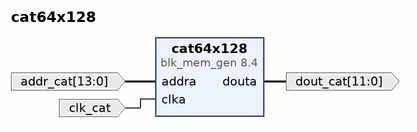
[diagram p0: block diagram of the top level]
# Vivado block design cat64x128, xc7a35tcpg236-1, Vivado 2023.2
create_bd_design cat64x128

create_bd_port -dir I -from 13 -to 0 addr_cat
create_bd_port -dir I -type clk clk_cat
create_bd_port -dir O -from 11 -to 0 dout_cat

create_bd_cell -type ip -vlnv xilinx.com:ip:blk_mem_gen:8.4 cat64x128
set_property -dict [list \
  CONFIG.Coe_File c:/Digital_Sys_Design/vga_sprites/vga_sprites.documents/cat.coe \
  CONFIG.Enable_A Always_Enabled \
  CONFIG.Load_Init_File true \
  CONFIG.Memory_Type Single_Port_ROM \
  CONFIG.Write_Depth_A 8193 \
  CONFIG.Write_Width_A 12 \
  CONFIG.use_bram_block Stand_Alone \
] [get_bd_cells cat64x128]

# ---- connections ----

connect_bd_net -net addra_0_1 [get_bd_ports addr_cat] [get_bd_pins cat64x128/addra]
connect_bd_net [get_bd_pins cat64x128/douta] [get_bd_ports dout_cat]
connect_bd_net -net clka_0_1 [get_bd_ports clk_cat] [get_bd_pins cat64x128/clka]

validate_bd_design
save_bd_design
